# EAGLE design lochitron_esp (EAGLE 7.4.0)
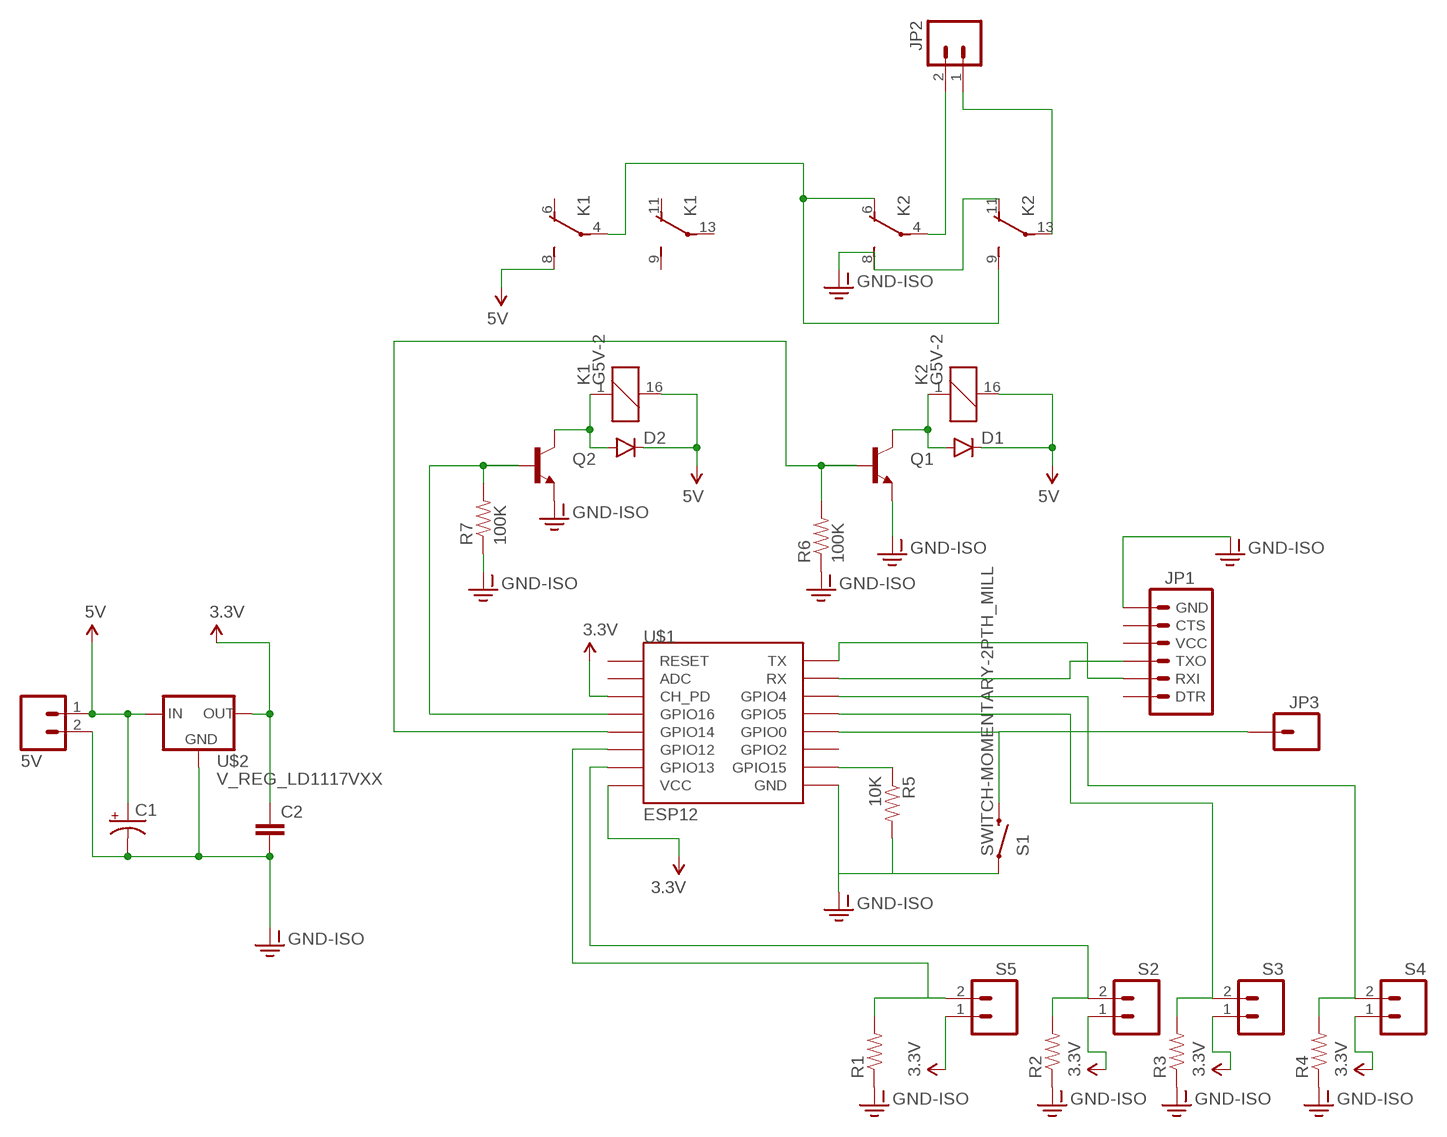
[diagram p0: schematic, sheet 1]

## Parts
5V  M02LOCK_LONGPADS  [1X02_LOCK_LONGPADS]
C1  100UF-25V-20%(PTH)  [CPOL-RADIAL-100UF-25V]
C2  0.1UF-50V-20%(PTH)KIT-EZ  [CAP-PTH-SMALL-KIT]
D1  DIODE1N4148  [DIODE-1N4148]
D2  DIODE1N4148  [DIODE-1N4148]
JP1  ARDUINO_SERIAL_PROGRAMLONGPADS  [1X06_LONGPADS]
JP2  M02LOCK_LONGPADS  [1X02_LOCK_LONGPADS]
JP3  M01PTH_LONGPAD  [1X01_LONGPAD]
K1  G5V-2  [G5V-2]
K2  G5V-2  [G5V-2]
Q1  TRANSISTOR_NPNBC547  [TO-92-AMMO]
Q2  TRANSISTOR_NPNBC547  [TO-92-AMMO]
R1  RESISTORAXIAL-0.3  [AXIAL-0.3]
R2  RESISTORAXIAL-0.3  [AXIAL-0.3]
R3  RESISTORAXIAL-0.3  [AXIAL-0.3]
R4  RESISTORAXIAL-0.3  [AXIAL-0.3]
R5  10K  RESISTORAXIAL-0.3  [AXIAL-0.3]
R6  100K  100KOHM-1/4W-1%(PTH)HORIZ  [AXIAL-0.3]
R7  100K  100KOHM-1/4W-1%(PTH)HORIZ  [AXIAL-0.3]
S1  SWITCH-MOMENTARY-2PTH_MILL  [TACTILE-PTH]
S2  M02LOCK_LONGPADS  [1X02_LOCK_LONGPADS]
S3  M02LOCK_LONGPADS  [1X02_LOCK_LONGPADS]
S4  M02LOCK_LONGPADS  [1X02_LOCK_LONGPADS]
S5  M02LOCK_LONGPADS  [1X02_LOCK_LONGPADS]
U$1  ESP12  [ESP12]
U$2  V_REG_LD1117VXX  [78XXL]

## Nets
3.3V: C2.1 S2.1 S3.1 S4.1 S5.1 U$1.CH_PD U$1.VCC U$2.GND(OUT)
5V: 5V.1 C1.1(+) D1.C D2.C K1.8(1:S) K1.16 K2.16 U$2.OUT(IN)
GND-ISO: 5V.2 C1.2(-) C2.2 JP1.6(GND) K2.8(1:S) K2.11(2:O) Q1.3(E) Q2.3(E) R1.P$1 R2.P$1 R3.P$1 R4.P$1 R5.P$2 R6.P$1 R7.P$1 S1.1 U$1.GND U$2.IN(GND)
N$1: D2.A K1.1 Q2.1(C)
N$2: D1.A K2.1 Q1.1(C)
N$4: JP3.1 S1.3 U$1.GPIO0
N$5: JP1.3(TXO) U$1.RX
N$6: JP1.2(RXI) U$1.TX
N$8: K1.4(1:P) K2.6(1:O) K2.9(2:S)
N$9: R5.P$1 U$1.GPIO15
N$10: R2.P$2 S2.2 U$1.GPIO13
N$11: Q2.2(B) R7.P$2 U$1.GPIO16
N$12: R4.P$2 S4.2 U$1.GPIO4
N$14: R3.P$2 S3.2 U$1.GPIO5
N$46: R1.P$2 S5.2 U$1.GPIO12
N$47: JP2.2 K2.4(1:P)
N$48: JP2.1 K2.13(2:P)
N$49: Q1.2(B) R6.P$2 U$1.GPIO14
Unconnected: JP1.1(DTR) JP1.4(VCC) JP1.5(CTS) K1.6(1:O) K1.9(2:S) K1.11(2:O) K1.13(2:P) U$1.ADC U$1.GPIO2 U$1.RESET

## Library data of the parts
5V JP2 S2-S5 = SparkFun-Connectors:M02: Standard 2-pin 0.1" header. Use with - straight break away headers ( PRT-00116) - right angle break away headers (PRT-00553) - swiss pins (PRT-00743) - machine pins (PRT-00117) - female headers (PRT-00115) Molex polarized connector foot print use with: PRT-08233 with associated crimp pins and housings. 2.54_SCREWTERM for use with PRT-10571. 3.5mm Screw Terminal footprints for PRT-08084 5mm Screw Terminal footprints for use with PRT-08432
C1 = SparkFun-Capacitors:100UF-25V-20%(PTH): CAP-08439; PROD_ID: CAP-08439
C2 = SparkFun-Capacitors:0.1UF-50V-20%(PTH): CAP-08370; PROD_ID: CAP-08370
D1 D2 = SparkFun-DiscreteSemi:DIODE: Diode These are standard reverse protection diodes and small signal diodes. SMA package can handle up to about 1A. SOD-323 can handle about 200mA. What the SOD-323 package when ordering, there are some mfgs out there that are 5-pin packages.
JP1 = SparkFun-Connectors:ARDUINO_SERIAL_PROGRAM: FTDI connector footprints
JP3 = SparkFun-Connectors:M01: Header 1 Standard 1-pin 0.1" header. Use with straight break away headers (SKU : PRT-00116), right angle break away headers (PRT-00553), swiss pins (PRT-00743), machine pins (PRT-00117), and female headers (PRT-00115).
K1 K2 = relay:G5V-2: OMRON PCB Relay Source: http://www.omron.com/ecb/products/pdf/en-g5v2.pdf; MPN: G5V-2 5DC; OC_FARNELL: 9949488; OC_NEWARK: 78K5703
Q1 Q2 = SparkFun-DiscreteSemi:TRANSISTOR_NPN: Generic NPN BJT MMBT2222A - TRANS-08049 (SOT-23, 1A 40V) MPSA42 - TRANS-09116 (SOT-23, 500mA 300V) MMBT5088LT1G - TRANS-11160 (SOT-23, 50 mA 30V) BC547 - COM-08928 <http://www.sparkfun.com/products/8928> (TO-92 45V 100mA) (1.Collector 2.Base 3.Emitter) 2N3904 - COM-00521 <http://www.sparkfun.com/products/521> (TO-92 40V 200mA) (1.Emitter 2.Base 3.Collector) P2N2222A - COM-12852 <http://www.sparkfun.com/products/12852> (TO-92 40V 600mA) (1.Collector 2.Base 3.Emitter)
R1-R5 = SparkFun-Resistors:RESISTOR: Resistor Basic schematic elements and footprints for 0603, 1206, and PTH resistors.
R6 R7 = SparkFun-Resistors:100KOHM-1/4W-1%(PTH): RES-12184; PROD_ID: RES-12184
S1 = SparkFun-Electromechanical:SWITCH-MOMENTARY-2: Various NO switches- pushbuttons, reed, etc; PROD_ID: SWCH-08441
U$1 = esp8266modules:ESP12: ESP8266 Wifi module 12
U$2 = SparkFun-PowerIC:V_REG_LD1117VXX: LD1117VXX voltage regulator. We carry the 3.3V version (COM-00526) in TO-220 package.

## Board
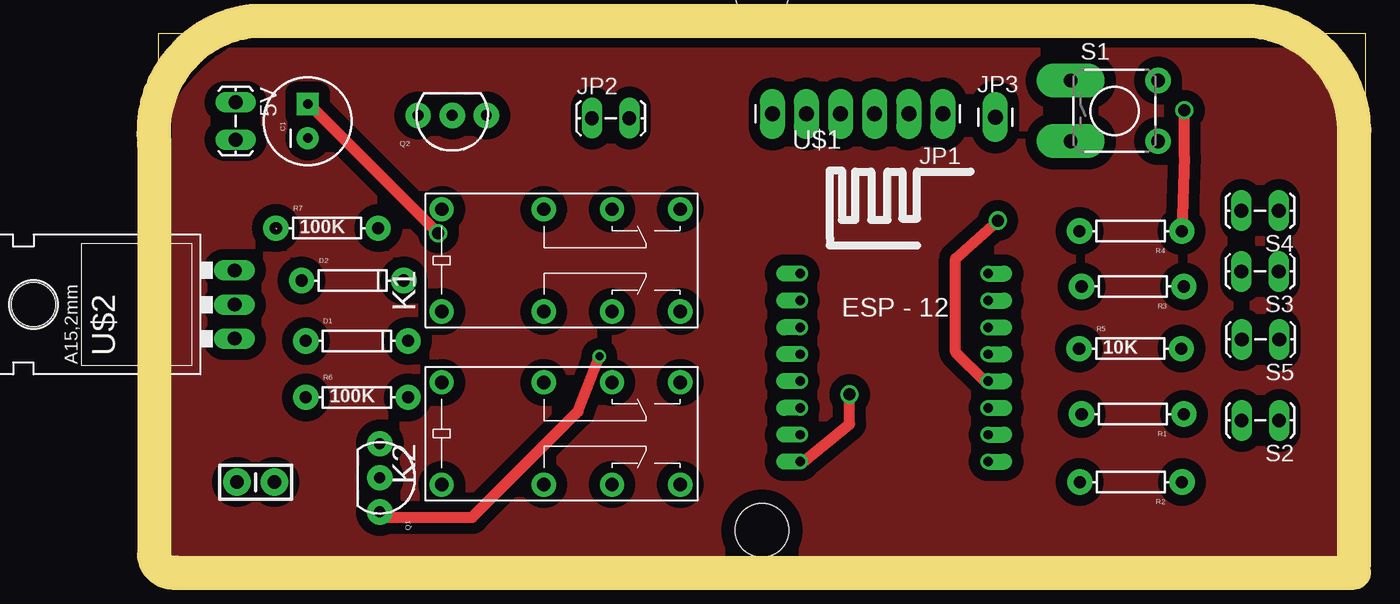
[diagram p1: board, top side]
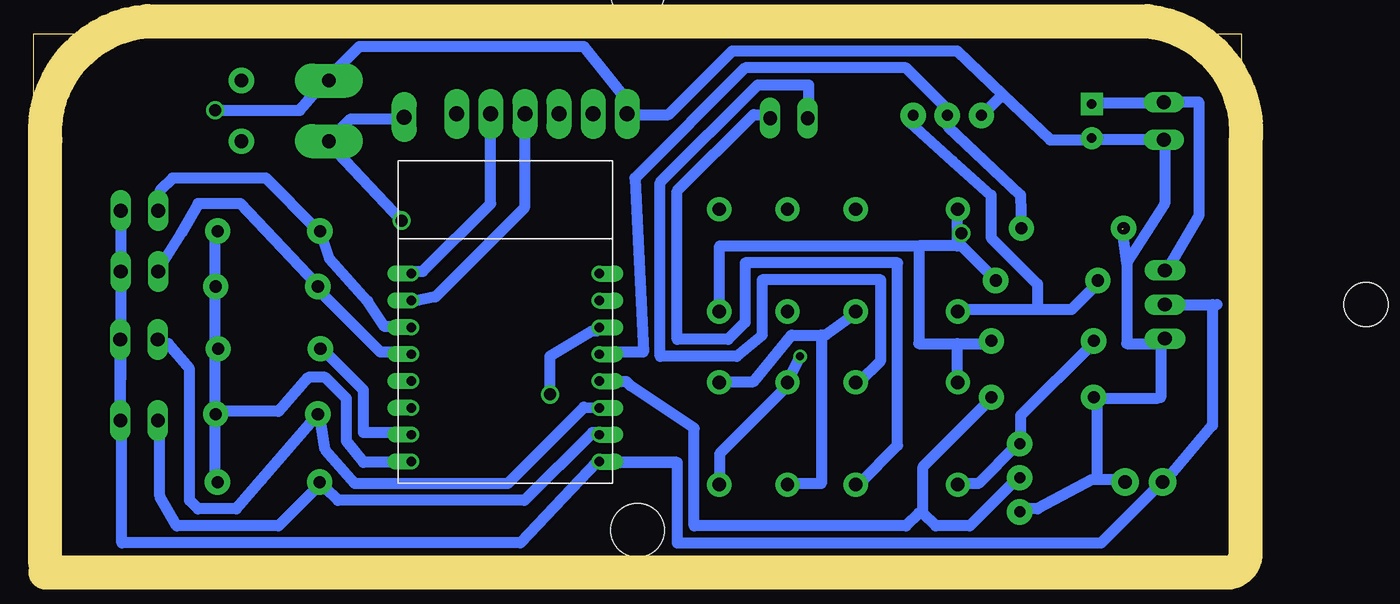
[diagram p2: board, bottom side, seen from below]

Size 90 x 40 mm. Coordinates in mm from the lower left corner, seen from the top.
Outline: 0,0 90,0 90,40 0,40 0,0
Copper layers (1*16): Top 0.035mm / dielectric 0.83mm / Bottom 0.035mm
Design rules "default *": minimum track width 10mil, minimum drill 24mil, track to track 0.4mm, track to pad 0.4mm, pad to pad 0.4mm, via to via 0.4mm, smd to smd 0.4mm, copper to edge 40mil, drill to drill 8mil, minimum pad ring 10mil, minimum via ring 8mil, stop-mask expansion 4mil, vias tented up to drill 0mil, thermal gap 10mil
Holes 4 mm at 45,3 45,43
Milling: 8 lines

### Footprints (pad centres in the part's own frame; a part is rotated, then mirrored left to right if it is on the bottom)
1X02_LOCK_LONGPADS = drill 1.016 long: 1 -0.127,0; 2 2.667,0
CPOL-RADIAL-100UF-25V = drill 0.7 pad 1.651 square: 1 1.27,0 | drill 0.7 pad 1.651: 2 -1.27,0
CAP-PTH-SMALL-KIT = drill 1.016 pad 2.032: 1 -1.397,0; 2 1.397,0
DIODE-1N4148 = drill 0.9 pad 1.88: A -3.81,0; C 3.81,0
1X06_LONGPADS = drill 1.118 pad 1.88 long: 1 0,0; 2 2.54,0; 3 5.08,0; 4 7.62,0; 5 10.16,0; 6 12.7,0
1X01_LONGPAD = drill 1.118 pad 1.88 long: 1 0,0
G5V-2 = drill 1 pad 1.8: 1 -8.89,-3.81; 4 -1.27,-3.81; 6 3.81,-3.81; 8 8.89,-3.81; 9 8.89,3.81; 11 3.81,3.81; 13 -1.27,3.81; 16 -8.89,3.81
TO-92-AMMO = drill 0.813 pad 1.88: 1 -2.54,0; 2 0,0; 3 2.54,0
AXIAL-0.3 = drill 0.9 pad 1.88: P$1 -3.81,0; P$2 3.81,0
TACTILE-PTH = drill 1.016 pad 2.54 long: 1 -3.251,2.261; 3 -3.251,-2.261 | drill 1.016 pad 1.88: 2 3.251,2.261; 4 3.251,-2.261
ESP12 = drill 0.7 offset: ADC -7.1,3.8; CH_PD -7.1,1.8; GND 6.9,-8.2; GPIO0 6.9,-2.2; GPIO2 6.9,-4.2; GPIO4 6.9,1.8; GPIO5 6.9,-0.2; GPIO12 -7.1,-4.2; GPIO13 -7.1,-6.2; GPIO14 -7.1,-2.2; GPIO15 6.9,-6.2; GPIO16 -7.1,-0.2; RESET -7.1,5.8; RX 6.9,3.8; TX 6.9,5.8; VCC -7.1,-8.2
78XXL = drill 1.016 long: GND 0,-3.81; IN -2.54,-3.81; OUT 2.54,-3.81 | hole 3.302: 0,11.176

### Placement (x,y rotation side)
5V  5.76,34.75 270 top
C1  11.13,33.48 90 top
C2  7.25,6.58 0 top
D1  14.8,17.1 0 top
D2  14.48,21.6 0 top
JP1  58.46,34.01 180 top
JP2  32.44,33.69 0 top
JP3  62.37,33.78 0 top
K1  30,23.1 0 top
K2  30,10.2 0 top
Q1  16.5,6.9 270 top
Q2  21.9,33.9 180 top
R1  72.62,11.65 180 top
R2  72.48,6.58 180 top
R3  72.62,21.16 180 top
R4  72.46,25.28 180 top
R5  72.43,16.52 0 top
R6  14.8,12.9 0 top
R7  12.57,25.5 0 top
S1  71.25,34.24 0 top
S2  83.4,11.17 180 top
S3  83.38,22.28 180 top
S4  83.38,26.8 180 top
S5  83.41,17.21 180 top
U$1  54.94,16.31 0 top
U$2  1.87,19.81 90 top

### Tracks (layer width: path | path; a pad name or v marks a point on that pad's centre or on a via)
3.3V  (via drill 0.9)
  Top 0.813: v51.51,13.11 51.51,10.9 48.03,8.06 U$1.VCC
  Bottom 0.813: S4.1 S3.1 83.51,17.16 S2.1 | S2.1 83.52,11.82 S5.1 | U$2.GND 5.4,19.8 1.8,19.8 2.12,19.82 2.13,19.52 2.13,10.8 5.7,6.6 C2.1 6,6.48 10.43,2.05 42.03,2.05 42.03,8.06 | 42.03,8.06 U$1.VCC | S2.1 83.42,10.9 83.42,2.05 53.72,2.05 48.03,8.06 42.03,8.06 | v51.51,13.11 51.51,15.96 48.35,17.85 48.03,17.85 U$1.CH_PD
5V  (via drill 0.9)
  Top 0.813: v20.86,25.12 11.38,34.6 C1.1
  Bottom 0.813: C1.1 11.1,34.8 5.78,34.8 5V.1 5.37,34.92 3.16,34.92 3.16,26.38 5.37,22.59 U$2.OUT | 21.17,25.12 21.17,26.7 K1.16 | 21.17,25.12 21.17,24.17 | D2.C 18.33,21.64 20.86,24.17 21.17,24.17 | 21.17,24.17 24.02,24.17 | 24.02,24.17 24.02,16.9 21.17,16.9 | 21.17,16.9 18.64,16.9 D1.C | 21.17,16.9 21.17,14.06 K2.16 | 24.02,24.17 38.87,24.17 38.87,19.43 K1.8 | v20.86,25.12 21.17,25.12
GND-ISO  (via drill 0.6, 0.9)  (1 unrouted)
  Top 0.813: v76.47,34.28 76.47,30.81 R4.P$1 | v32.86,15.96 31.28,11.85 23.38,3.95 17.06,3.95 16.75,4.26 Q1.3
  Bottom 0.813: 8.7,6.6 C2.2 8.85,6.79 10.74,6.79 | 8.53,22.91 5.69,27.33 5.69,31.76 5V.2 5.78,32.1 11.1,32.1 C1.2 11.38,32.07 14.22,32.07 17.78,35.47 | 8.53,22.91 8.53,16.9 6.32,16.9 U$2.IN 5.7,17.1 6,16.8 6,12.9 6.32,12.8 11.06,12.8 R6.P$1 10.74,12.8 10.74,6.79 | 8.53,22.91 8.85,25.44 | 17.78,35.47 21.17,38.71 37.92,38.71 42.66,33.97 45.5,33.97 JP1.6 45.19,34.28 48.98,39.02 65.73,39.02 67.94,36.81 S1.1 68.26,36.5 70.15,34.28 v76.47,34.28 | U$1.GND 61.94,8.06 65.41,8.06 66.68,9.64 66.68,12.8 68.26,14.38 69.52,14.38 71.73,11.85 76.16,11.85 R1.P$1 | R1.P$1 76.47,11.53 76.47,6.48 R2.P$1 | R1.P$1 76.47,12.16 76.47,16.27 R5.P$2 76.47,16.9 76.47,21.01 R3.P$1 76.47,21.33 76.47,25.12 R4.P$1 | Q2.3 19.28,33.97 18.01,35.23 17.78,35.47 | Q1.3 16.43,4.58 15.17,4.58 11.06,6.79 10.74,6.79 | K2.8 38.87,6.48 38.87,8.69 33.81,13.74 K2.11 33.81,14.06 v32.86,15.96
N$1
  Bottom 0.813: D2.A 10.74,21.33 12.64,19.43 15.17,19.43 | 15.17,19.43 20.86,19.43 K1.1 | Q2.1 24.33,33.65 24.65,33.34 21.49,30.49 18.64,27.96 18.64,24.8 15.17,21.33 15.17,19.43
N$2
  Bottom 0.813: D1.A 11.06,16.9 16.43,11.53 16.43,9.64 Q1.1 16.75,9.32 19.59,6.48 20.86,6.48 K2.1
N$3
  pour Top (isolate 0.83): 0,28.91 arc-90 11.38,40.29 16.12,40.29 81.53,40.29 arc-90 90.06,31.76 90.06,0.47 0,0.47
N$4  (via drill 0.9)
  Top 0.813: v62.57,26.07 59.41,23.22 59.41,16.27 61.62,14.06 U$1.GPIO0
  Bottom 0.813: JP3.1 62.57,33.65 66.36,33.65 67.94,32.07 S1.3 67.94,31.76 v62.57,26.07
N$5
  Bottom 0.813: U$1.RX 61.62,20.06 60.04,20.38 53.4,27.02 53.4,33.97 JP1.3
N$6
  Bottom 0.813: JP1.2 55.93,33.97 55.93,27.33 60.99,22.28 61.62,22.28 U$1.TX
N$8
  Bottom 0.813: K2.9 38.87,14.06 36.34,14.06 33.5,17.54 31.28,17.54 | 31.28,17.54 31.28,6.48 33.5,6.48 K2.6 | 31.28,17.54 30.97,17.54 28.76,19.12 K1.4
N$9
  Bottom 0.813: R5.P$1 68.57,16.59 65.41,13.43 65.41,10.27 61.94,10.27 U$1.GPIO15
N$10
  Bottom 0.813: U$1.GPIO13 48.03,10.27 48.35,10.27 53.4,5.21 67.31,5.21 68.26,6.16 68.57,6.16 R2.P$2 68.89,6.16 71.73,3.32 79.32,3.32 80.58,5.53 80.58,10.9 S2.2
N$11
  Bottom 0.813: U$1.GPIO16 47.72,16.27 44.56,16.27 45.19,29.23 36.97,37.44 24.96,37.44 21.8,34.28 Q2.2 22.12,33.65 21.8,33.02 16.43,27.96 R7.P$2
N$12
  Bottom 0.813: U$1.GPIO4 61.94,18.17 63.83,18.17 65.1,20.06 67.94,23.22 68.57,25.12 R4.P$2 68.89,25.44 72.68,29.23 79.63,29.23 80.58,28.28 80.58,27.02 S4.2
N$14
  Bottom 0.813: U$1.GPIO5 61.94,16.27 64.15,16.27 68.57,20.7 68.57,21.01 R3.P$2 68.89,21.33 74.58,27.33 77.74,27.33 79,25.12 80.58,22.59 S3.2
N$46
  Bottom 0.813: U$1.GPIO12 48.98,12.16 54.67,6.48 66.04,6.48 68.26,9 68.57,10.9 68.57,11.53 R1.P$2 68.89,11.53 73,6.79 74.89,4.58 77.74,4.58 78.37,5.21 78.37,15.01 79.95,16.9 80.58,16.9 S5.2
N$47
  Bottom 0.813: K2.4 28.44,6.48 25.6,9.32 25.6,22.91 36.97,22.91 36.97,18.48 38.24,17.22 42.03,17.22 42.03,28.28 36.34,33.97 35.39,33.97 JP2.2
N$48
  Bottom 0.813: K2.13 28.44,14.06 26.86,15.64 26.86,21.64 35.71,21.64 35.71,17.54 37.6,15.96 43.29,15.96 43.29,28.91 36.02,36.18 32.23,36.18 32.23,34.28 JP2.1
N$49
  Bottom 0.813: 23.7,4.26 22.75,3.32 20.22,3.32 16.75,6.79 Q1.2 | 23.7,4.26 23.7,7.74 18.64,12.8 R6.P$2 | 23.7,4.26 24.02,4.26 24.96,3.32 40.76,3.32 40.76,10.58 45.5,13.74 45.82,14.06 47.72,14.06 U$1.GPIO14